# EAGLE design VoltRefBoard (EAGLE 7.5.0)
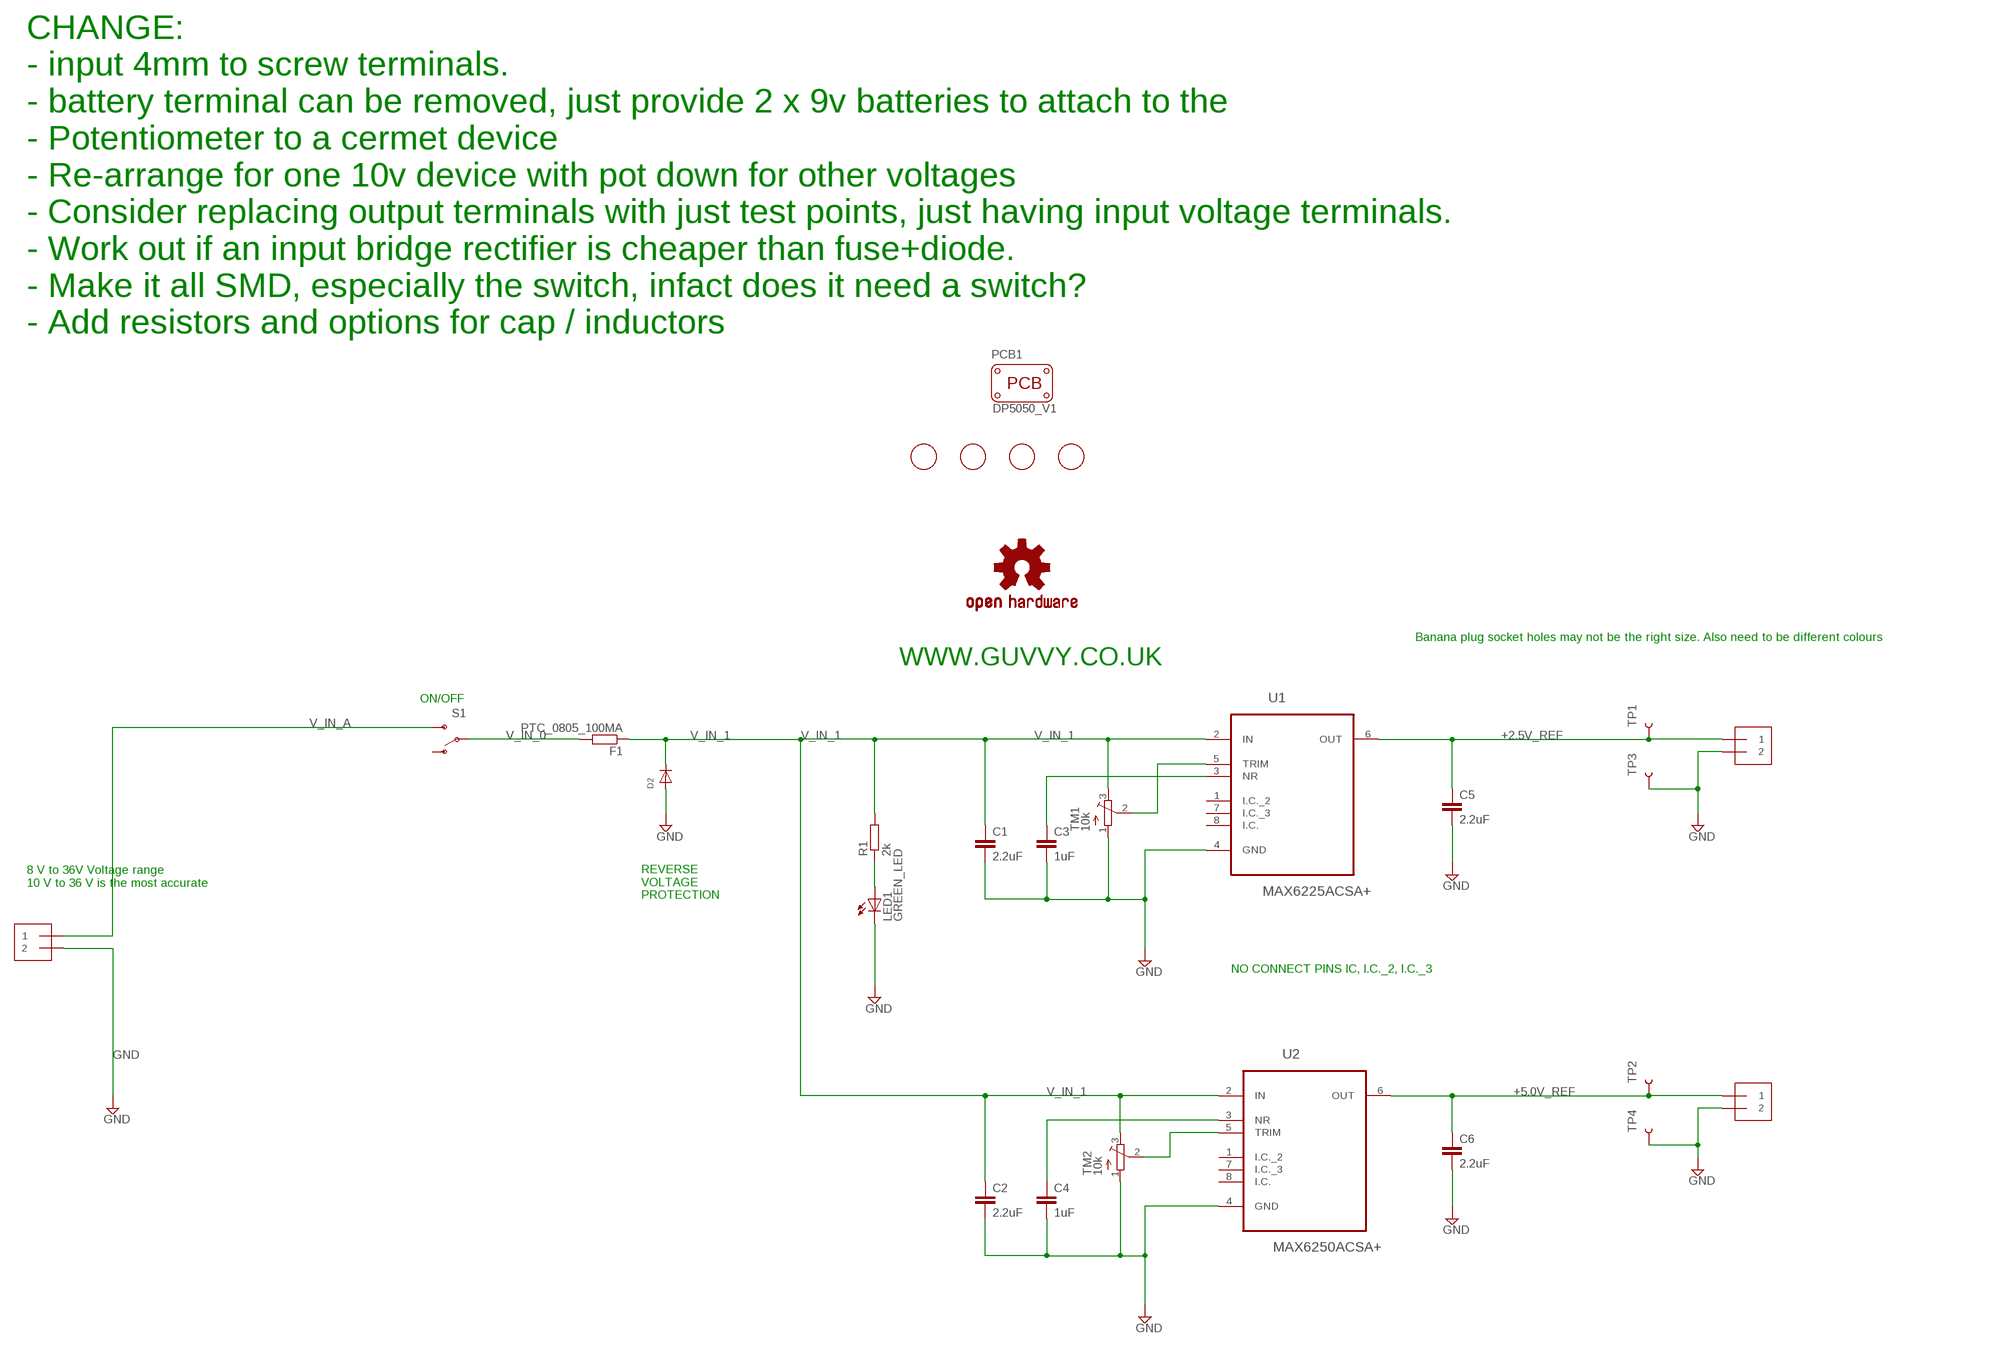
[diagram p0: schematic, sheet 1]

## Parts
C1  2.2uF  C-EUC0805  [C0805]
C2  2.2uF  C-EUC0805  [C0805]
C3  1uF  C-EUC0805  [C0805]
C4  1uF  C-EUC0805  [C0805]
C5  2.2uF  C-EUC0805  [C0805]
C6  2.2uF  C-EUC0805  [C0805]
D2  DIODESOD-323F  [SOD-323F]
F1  PTC_0805_100MA  R-EU_R0805  [R0805]
J1  1X2-3.5MM  [1X2-3.5MM]
J2  1X2-3.5MM  [1X2-3.5MM]
J6  1X2-3.5MM  [1X2-3.5MM]
LED1  GREEN_LED  LEDP-LCC-2  [P-LCC-2]
LOGO1  OSHW-LOGOL  [OSHW-LOGO-L]
PCB1  PCB_DP_SQUARE-5X5  [DP5050_V1]
R1  2k  R-EU_R0805  [R0805]
S1  SWITCH-SPDT-SMD-A  [SWITCH-SPST-SMD-A]
TM1  10k  TRIMPOTTC33X  [TC33X]
TM2  10k  TRIMPOTTC33X  [TC33X]
TP1  TP_1MM_TH"  [TP_1MM_TH]
TP2  TP_1MM_TH"  [TP_1MM_TH]
TP3  TP_1MM_TH"  [TP_1MM_TH]
TP4  TP_1MM_TH"  [TP_1MM_TH]
U1  MAX6225ACSA+  [SOIC127P600X175-8N]
U2  MAX6250ACSA+  [SOIC127P600X175-8N]
U$1  FIDUCIAL  [FIDUCIAL_1MM]
U$2  FIDUCIAL  [FIDUCIAL_1MM]
U$3  FIDUCIAL  [FIDUCIAL_1MM]
U$4  FIDUCIAL  [FIDUCIAL_1MM]

## Nets
+2.5V_REF: C5.1 J1.1 TP1.P$1 U1.6(OUT)
+5.0V_REF: C6.1 J2.1 TP2.P$1 U2.6(OUT)
GND: C1.2 C2.2 C3.2 C4.2 C5.2 C6.2 D2.A J1.2 J2.2 J6.2 LED1.C TM1.1(A) TM2.1(A) TP3.P$1 TP4.P$1 U1.4(GND) U2.4(GND)
N$1: TM2.2(S) U2.5(TRIM)
N$3: TM1.2(S) U1.5(TRIM)
N$6: C4.1 U2.3(NR)
N$15: C3.1 U1.3(NR)
N$30: LED1.A R1.1
V_IN_0: F1.2 S1.2(P)
V_IN_1: C1.1 C2.1 D2.C F1.1 R1.2 TM1.3(E) TM2.3(E) U1.2(IN) U2.2(IN)
V_IN_A: J6.1 S1.3(S)
Unconnected: S1.1(O) U1.1(I.C._2) U1.7(I.C._3) U1.8(I.C.) U2.1(I.C._2) U2.7(I.C._3) U2.8(I.C.)

## Notes on the sheet
- CHANGE: 
  - input 4mm to screw terminals. 
  - battery terminal can be removed, just provide 2 x 9v batteries to attach to the 
  - Potentiometer to a cermet device
  - Re-arrange for one 10v device with pot down for other voltages
  - Consider replacing output terminals with just test points, just having input voltage terminals. 
  - Work out if an input bridge rectifier is cheaper than fuse+diode. 
  - Make it all SMD, especially the switch, infact does it need a switch?
  - Add resistors and options for cap / inductors
- Banana plug socket holes may not be the right size. Also need to be different colours
- WWW.GUVVY.CO.UK
- ON/OFF
- 8 V to 36V Voltage range
  10 V to 36 V is the most accurate
- REVERSE
  VOLTAGE
  PROTECTION
- NO CONNECT PINS IC, I.C._2, I.C._3

## Library data of the parts
C1-C6 = rcl:C-EU: CAPACITOR, European symbol; OC_FARNELL: unknown
D2 = adafruit:DIODE: Diode SMADIODE - SMA Surface Mount Package 20V 1A Schottky Diode Digikey: 641-1014-6-ND DO-1N4148 - Through Hole Small Current Diode SOD-123 20V 1 A (.5mV Vf) Schottky Diode - Digikey: MBRX120TPMSCT-ND SOD-323 10V 570mA (.38mV Vf, 3ns) Schottky Diode - Digikey: ZLLS410CT-ND SOD-523 30V 30mA Schottky Diode (RB751S-40TE61) - Digikey: RB751S-40TE61CT-ND SOT23-R/W - SOT23 Package (R = Solder Paste/Reflow Ovens, W = Hand-Soldering) BAT54Film 40V 300mA - Digikey: 497-7162-1-ND; MF: NXP; MPN: PMEG3010EJ,115; OC_FARNELL: 1757770
F1 = rcl:R-EU_: RESISTOR, European symbol; MF: TE CONNECTIVITY / RAYCHEM; MPN: MINISMDC110F/24-2; OC_FARNELL: 1345925
J1 J2 J6 = adafruit:1X2: 3.5mm Terminal block http://www.ladyada.net/library/pcb/eaglelibrary.html; OC_FARNELL: unknown
LED1 = P-LCC-2_Shorter:LED: LED OSRAM: - CHIPLED LG R971, LG N971, LY N971, LG Q971, LY Q971, LO R971, LY R971 LH N974, LH R974 LS Q976, LO Q976, LY Q976 LO Q996 - Hyper CHIPLED LW Q18S LB Q993, LB Q99A, LB R99A - SideLED LS A670, LO A670, LY A670, LG A670, LP A670 LB A673, LV A673, LT A673, LW A673 LH A674 LY A675 LS A676, LA A676, LO A676, LY A676, LW A676 LS A679, LY A679, LG A679 - Hyper Micro SIDELED® LS Y876, LA Y876, LO Y876, LY Y876 LT Y87S - SmartLED LW L88C, LW L88S LB L89C, LB L89S, LG L890 LS L89K, LO L89K, LY L89K LS L896, LA L896, LO L896, LY L896 - TOPLED LS T670, LO T670, LY T670, LG T670, LP T670 LSG T670, LSP T670, LSY T670, LOP T670, LYG T670 LG T671, LOG T671, LSG T671 LB T673, LV T673, LT T673, LW T673 LH T674 LS T676, LA T676, LO T676, LY T676, LB T676, LH T676, LSB T676, LW T676 LB T67C, LV T67C, LT T67C, LS T67K, LO T67K, LY T67K, LW E67C LS E67B, LA E67B, LO E67B, LY E67B, LB E67C, LV E67C, LT E67C LW T67C LS T679, LY T679, LG T679 LS T770, LO T770, LY T770, LG T770, LP T770 LB T773, LV T773, LT T773, LW T773 LH T774 LS E675, LA E675, LY E675, LS T675 LS T776, LA T776, LO T776, LY T776, LB T776 LHGB T686 LT T68C, LB T68C - Hyper Mini TOPLED® LB M676 - Mini TOPLED Santana® LG M470 LS M47K, LO M47K, LY M47K Source: http://www.osram.convergy.de/; MF: OSRAM; MPN: LGT67K-H2K1-24-Z; OC_FARNELL: 1226376
LOGO1 = SparkFun-Aesthetics:OSHW-LOGO: Open Source Hardware Logo This logo indicates the piece of hardware it is found on incorporates a OSHW license and/or adheres to the definition of open source hardware found here: http://freedomdefined.org/OSHW; OC_FARNELL: unknown
PCB1 = dp_devices:PCB_DP_SQUARE: Dangerous Prototypes Standard Square PCB sizes; OC_FARNELL: unknown; PCB_SIZE: DP5050_V1
R1 = rcl:R-EU_: RESISTOR, European symbol; OC_FARNELL: unknown
S1 = SparkFun-Electromechanical:SWITCH-SPDT: SPDT Switch Simple slide switch, Spark Fun Electronics SKU : COM-00102 DPDT SMT slide switch, AYZ0202, SWCH-08179; OC_FARNELL: unknown
TM1 TM2 = P-LCC-2_Shorter:TRIMPOT: SMT trimmer potentiometer part number TC33X http://www.ladyada.net/library/eagle; MF: VISHAY SFERNICE; MPN: TS53YJ103MR10; OC_FARNELL: 1141485
TP1-TP4 = TP_1MM_TH:TP_1MM_TH: Bare copper test points for troubleshooting or ICT; MF: MULTICOMP; MPN: TEST-3; OC_FARNELL: 1702006
U1 = MAX6225ACSA+:MAX6225ACSA+; DESCRIPTION: Low-Noise, Precision, +2.5V/+4.096V/+5V Voltage References; MF: MAXIM INTEGRATED PRODUCTS; MPN: MAX6225ACSA+.; OC_FARNELL: 2113189; OC_NEWARK: 59J3522; PACKAGE: SOIC-8; SUPPLIER: Maxim
U2 = MAX62250ACSA+:MAX6250ACSA+: Low-Noise, Precision, +2.5V/+4.096V/+5V Voltage References; MF: MAXIM INTEGRATED PRODUCTS; MPN: MAX6250ACSA+.; OC_FARNELL: 1673181; OC_NEWARK: 57K8967; PACKAGE: SOIC-8; SUPPLIER: Maxim
U$1-U$4 = adafruit:FIDUCIAL: For use by pick and place machines to calibrate the vision/machine, 1mm By microbuilder.eu; OC_FARNELL: unknown

## Board
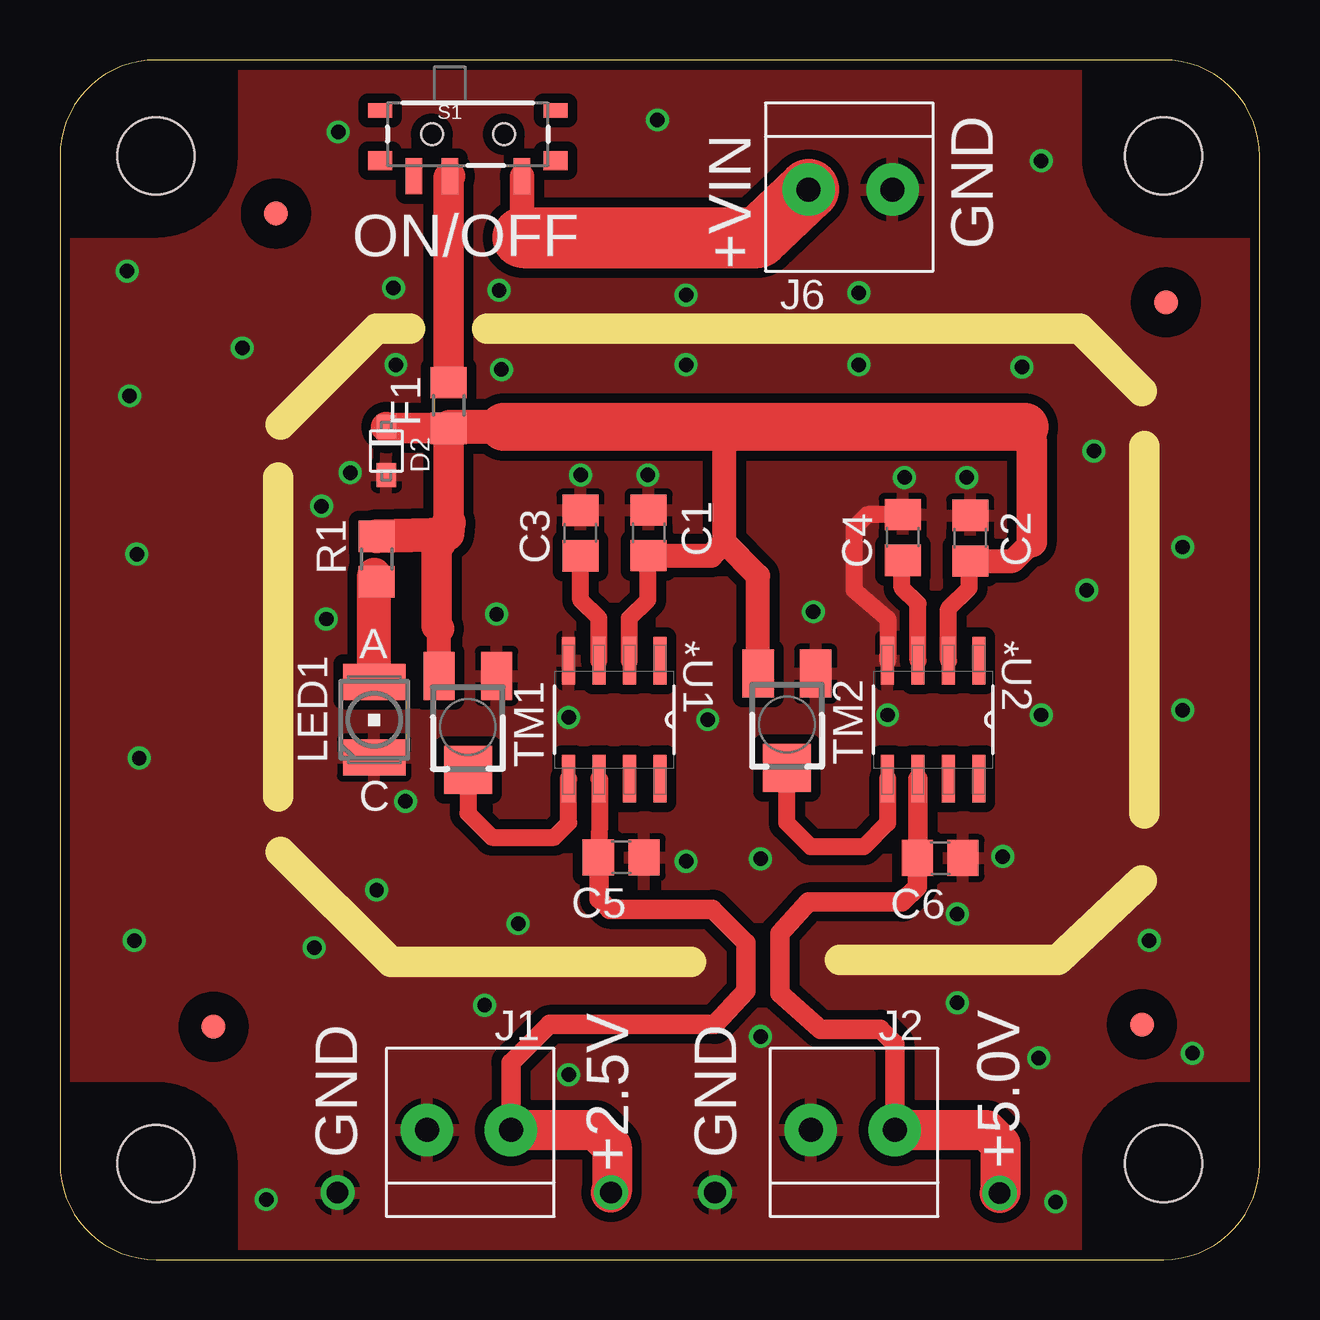
[diagram p1: board, top side]
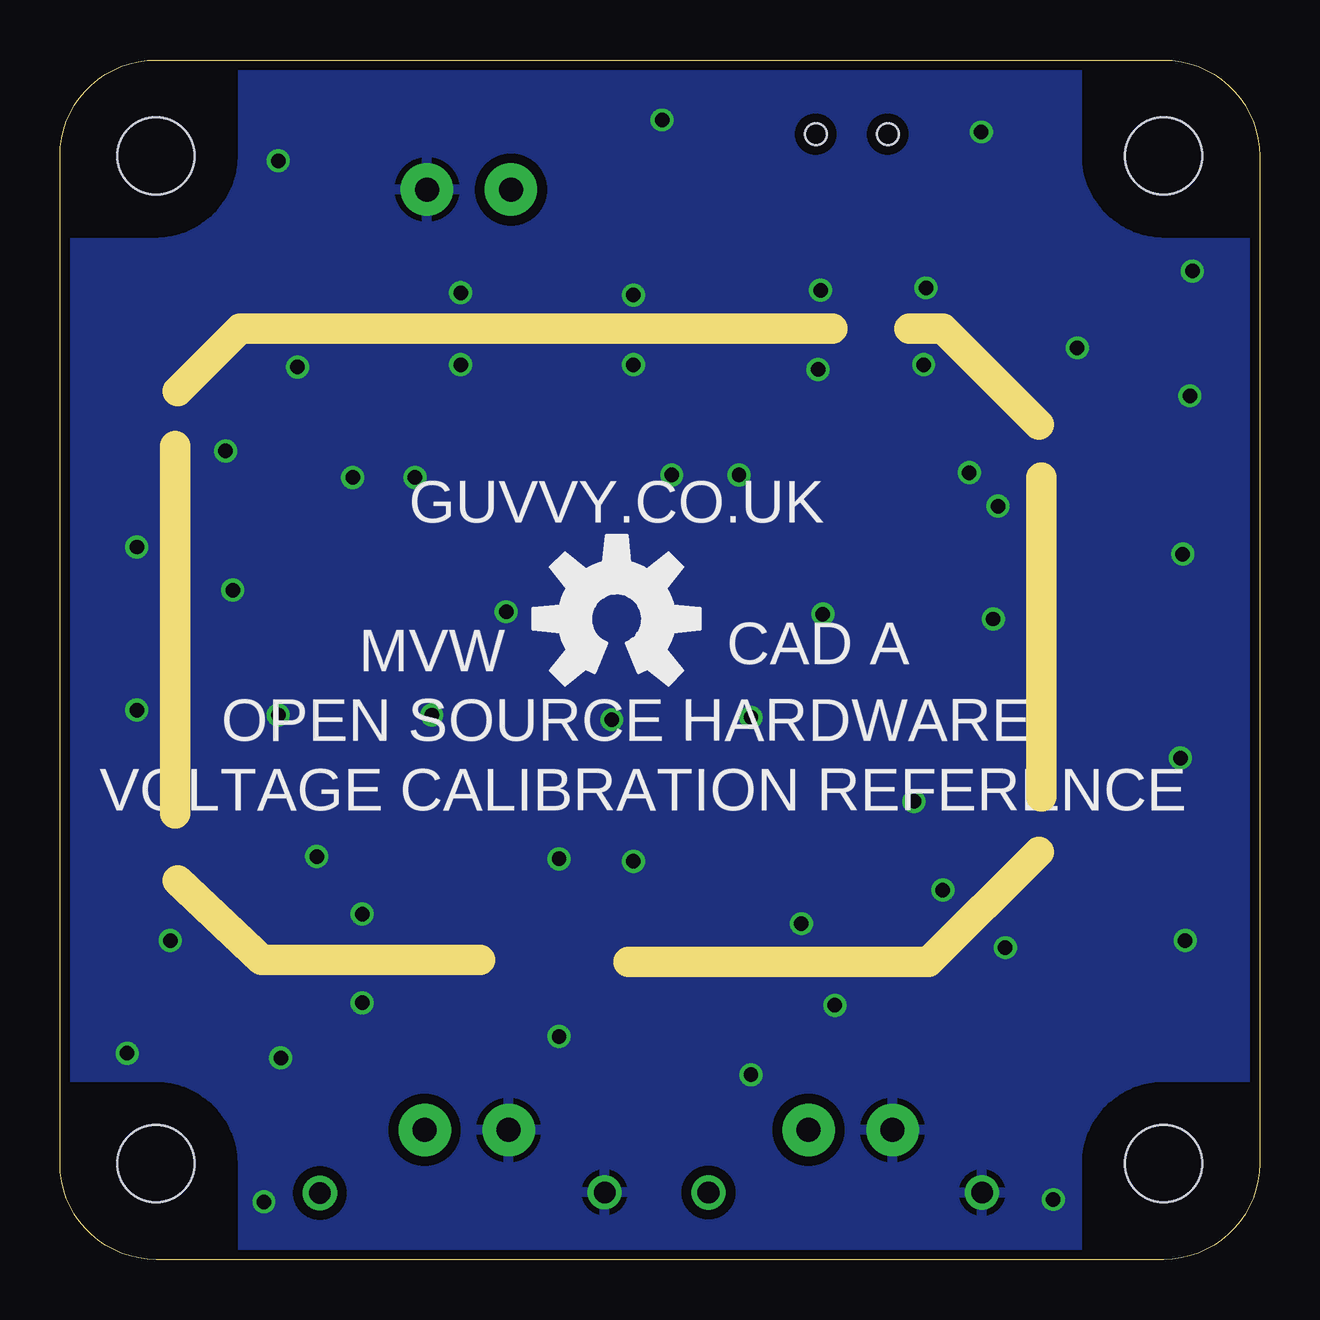
[diagram p2: board, bottom side, seen from below]

Size 50 x 50 mm. Coordinates in mm from the lower left corner, seen from the top.
Copper layers (1*16): Top 0.0356mm / dielectric 1.5011mm / Bottom 0.0356mm
Design rules "LaenPCBOrder": minimum track width 6mil, minimum drill 13mil, track to track 6mil, track to pad 6mil, pad to pad 6mil, via to via 6mil, smd to smd 6mil, copper to edge 15mil, drill to drill 6mil, minimum pad ring 7mil, minimum via ring 7mil, stop-mask expansion 3mil, vias tented up to drill 0mil, thermal gap 10mil
Milling: 10 lines

### Footprints (pad centres in the part's own frame; a part is rotated, then mirrored left to right if it is on the bottom)
C0805 = smd 1.3 x 1.5: 1 -0.95,0; 2 0.95,0
SOD-323F = smd 1 x 0.8: A -1,0; C 1,0
R0805 = smd 1.3 x 1.5: 1 -0.95,0; 2 0.95,0
1X2-3.5MM = drill 1 pad 2.184: 1 1.8,0; 2 -1.7,0
P-LCC-2 = smd 2.6 x 1.5: A 0,1.58; C 0,-1.58
DP5050_V1 = hole 3.2: -21,-21; 21,-21; 21,21; -21,21
SWITCH-SPST-SMD-A = smd 0.7 x 1.5: 1 -2.25,-1.75; 2 -0.75,-1.75; 3 2.25,-1.75 | smd 1 x 0.6: GND1 -3.65,1; GND3 3.65,1 | smd 1 x 0.8: GND2 -3.65,-1.1; GND4 3.65,-1.1 | hole 0.9: -1.5,0; 1.5,0
TC33X = smd 1.3 x 2: 1 -1.2,-2.125; 3 1.2,-2.125 | smd 2 x 2: 2 0,1.8
TP_1MM_TH = drill 0.9 pad 1.422: P$1 0,0
SOIC127P600X175-8N = smd 1.981 x 0.533: 1 -2.464,1.905; 2 -2.464,0.635; 3 -2.464,-0.635; 4 -2.464,-1.905; 5 2.464,-1.905; 6 2.464,-0.635; 7 2.464,0.635; 8 2.464,1.905
FIDUCIAL_1MM = smd 1 x 1: 1 0,0

### Placement (x,y rotation side)
C1  24.54,30.29 90 top
C2  37.94,30.07 90 top
C3  21.69,30.28 90 top
C4  35.13,30.1 90 top
C5  23.39,16.77 0 top
C6  36.69,16.73 0 top
D2  13.6,33.7 90 top
F1  16.2,35.6 90 top
J1  17,5.4 0 top
J2  33,5.4 0 top
J6  33,44.6 180 top
LED1  13.1,22.5 0 top
LOGO1  26.8,26.7 0 bottom
PCB1  25,25 0 top
R1  13.2,29.2 90 top
S1  17,46.9 0 top
TM1  17,22.2 180 top
TM2  30.3,22.3 180 top
TP1  22.97,2.79 0 top
TP2  39.17,2.77 0 top
TP3  11.57,2.79 0 top
TP4  27.3,2.8 0 top
U1  23.1,22.5 270 top
U2  36.4,22.5 270 top
U$1  6.4,9.7 0 top
U$2  45.1,9.8 0 top
U$3  46.1,39.9 0 top
U$4  9,43.6 0 top

### Tracks (layer width: path | path; a pad name or v marks a point on that pad's centre or on a via)
+2.5V_REF
  Top 0.7: C5.1 22.47,16.33 22.5,18.4 22.5,20 U1.6
  Top 0.813: 22.47,16.33 22.47,15.03 22.9,14.6 27.2,14.6 28.6,13.2 28.6,11.2 27.3,9.8 20.4,9.8 18.8,8.2 J1.1
  Top 1.676: J1.1 22.3,5.4 23,4.7 23,2.83 TP1.P$1
+5.0V_REF
  Top 0.813: U2.6 35.77,16.75 C6.1 35.74,15.54 35.1,14.9 31.2,14.9 30,13.6 30,11.1 31.7,9.6 34.2,9.6 34.8,9 J2.1
  Top 1.676: J2.1 38.6,5.4 39.2,4.8 39.2,2.8 TP2.P$1
GND  (via drill 0.6)
  Top 0.7: C4.2 33.65,31.05 33.1,30.5 33.1,27.9 34.5,26.7 34.5,25.16 U2.4
  other vias: 35.2,32.6 18.3,40.4 21.7,32.7 37.8,32.6 40.9,45.8 24.5,32.7 26.1,16.6 37.4,14.4 34.5,22.7 21.2,22.6 18.2,26.9 31.4,27 29.2,16.7 19.1,14 46.8,22.9 13.9,40.5 3.2,29.4 40.9,22.7 7.6,38 3.1,13.3 3.3,20.9 43.1,33.7 27,22.5 8.6,2.5 46.8,29.7 12.1,32.8 14.4,19.1 41.5,2.4 40.8,8.4 47.2,8.6 33.3,40.3 11.6,47 24.9,47.5 17.7,10.6 13.2,15.4 10.6,13 37.4,10.7 39.3,16.8 45.4,13.3 18.4,37.1 33.3,37.3 26.1,37.3 40.1,37.2 42.8,27.9 10.9,31.4 11.1,26.7 14,37.3 2.8,41.2 2.9,36 26.1,40.2 29.2,9.3 21.2,7.7
  pour Top (isolate 0.406): -2.54,-2.54 -2.54,82.55 102.87,82.55 102.87,-2.54
  pour Bottom (isolate 0.406): -1.27,81.28 101.6,81.28 101.6,-2.54 -1.27,-2.54
N$1
  Top 0.7: U2.5 34.49,18.2 33.5,17.2 31.3,17.2 30.3,18.2 TM2.2
N$3
  Top 0.7: TM1.2 17,18.6 18,17.6 20.6,17.6 21.2,18.2 U1.5
N$6
  Top 0.7: U2.3 35.77,27.34 35.1,28 35.1,29.12
  Top 1: 35.1,29.12 C4.1
N$15
  Top 0.7: U1.3 22.46,26.73 21.7,27.5 C3.1
  Top 1: C3.1
N$30
  Top 1.422: LED1.A 13.1,28.55 R1.1
V_IN_0
  Top 1.27: F1.2 16.2,45.1 S1.2
V_IN_1
  Top 0.7: U2.2 37.03,27.14 37.9,28 37.9,29.08 | U1.2 23.73,26.73 24.5,27.5 24.5,29.38
  Top 1: 37.9,29.08 C2.1 39.72,29.12 40.5,29.9 | 27.7,29.9 27.14,29.34 C1.1 24.5,29.38 | TM2.3 29.1,28.5 27.7,29.9 | 27.7,29.9 27.7,34.2 27.9,34.7 | TM1.3 15.8,26.3
  Top 1.27: 15.8,26.3 15.7,26.4 15.7,29.6 16.1,30.2 16.2,30.7 F1.1 13.65,34.65 D2.C | 40.2,34.7 40.2,34.4 40.5,34.1 40.5,29.9
  Top 1.422: 18.5,34.7 16.25,34.7 F1.1 | R1.2 16.15,30.25 16.2,30.7
  Top 2: 40.2,34.7 27.9,34.7 18.5,34.7
V_IN_A
  Top 1.016: S1.3 19.25,43.65 19.3,43.6 19.3,42.6
  Top 2.54: 19.3,42.6 29.1,42.6 J6.1

### Text on the board
tNames: GND | +VIN | ON/OFF | GND | +2.5V | GND | +5.0V
bNames: GUVVY.CO.UK | CAD A | MVW | OPEN SOURCE HARDWARE | VOLTAGE CALIBRATION REFERENCE